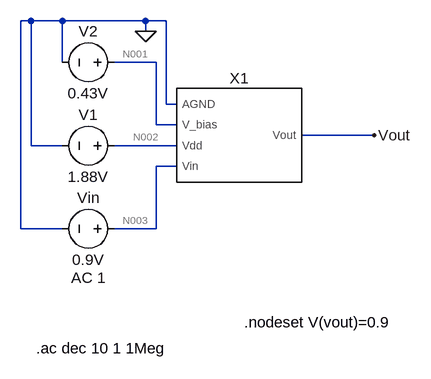
[diagram p0: schematic ota_c_lowpass_Slow.asc]
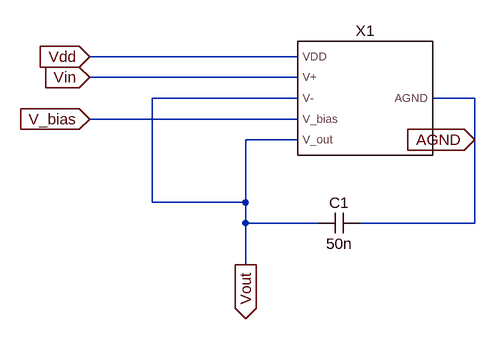
[diagram p1: sub-circuit ota_c_lowpass.asc]
ota_c_lowpass_Slow.asc, the LTspice schematic file:
Version 4.1
SHEET 1 880 680
WIRE -112 -16 -128 -16
WIRE -64 -16 -112 -16
WIRE 64 -16 -64 -16
WIRE 96 -16 64 -16
WIRE 64 0 64 -16
WIRE -64 48 -64 -16
WIRE 80 48 16 48
WIRE 96 112 96 -16
WIRE 112 112 96 112
WIRE 80 144 80 48
WIRE 112 144 80 144
WIRE 416 160 304 160
WIRE -112 176 -112 -16
WIRE -64 176 -112 176
WIRE 112 176 16 176
WIRE 112 208 80 208
WIRE -128 304 -128 -16
WIRE -64 304 -128 304
WIRE 80 304 80 208
WIRE 80 304 16 304
FLAG 64 0 0
FLAG 416 160 Vout
SYMBOL voltage 32 176 R90
WINDOW 0 -32 56 VBottom 2
WINDOW 3 32 56 VTop 2
SYMATTR InstName V1
SYMATTR Value 1.88V
SYMBOL voltage 32 304 R90
WINDOW 0 -32 56 VBottom 2
WINDOW 3 32 56 VTop 2
WINDOW 123 60 56 VTop 2
WINDOW 39 0 0 Left 0
SYMATTR InstName Vin
SYMATTR Value 0.9V
SYMATTR Value2 AC 1
SYMBOL voltage 32 48 R90
WINDOW 0 -32 56 VBottom 2
WINDOW 3 32 56 VTop 2
WINDOW 123 0 0 Left 0
WINDOW 39 0 0 Left 0
SYMATTR InstName V2
SYMATTR Value 0.43V
SYMBOL ota_c_lowpass 208 160 R0
SYMATTR InstName X1
TEXT -104 488 Left 2 !.ac dec 10 1 1Meg
TEXT 216 448 Left 2 !.nodeset V(vout)=0.9

ota_c_lowpass.asc, the sub-circuit schematic file:
Version 4.1
SHEET 1 880 680
WIRE 112 112 -208 112
WIRE 112 144 -208 144
WIRE 112 176 -112 176
WIRE 384 176 320 176
WIRE 112 208 -208 208
WIRE 112 240 32 240
WIRE 384 240 384 176
WIRE -112 336 -112 176
WIRE 32 336 32 240
WIRE 32 336 -112 336
WIRE 32 368 32 336
WIRE 144 368 32 368
WIRE 384 368 384 240
WIRE 384 368 208 368
WIRE 32 432 32 368
FLAG -208 144 Vin
IOPIN -208 144 In
FLAG 32 432 Vout
IOPIN 32 432 Out
FLAG -208 112 Vdd
IOPIN -208 112 In
FLAG -208 208 V_bias
IOPIN -208 208 In
FLAG 384 240 AGND
IOPIN 384 240 In
SYMBOL cap 208 352 R90
WINDOW 0 0 32 VBottom 2
WINDOW 3 32 32 VTop 2
SYMATTR InstName C1
SYMATTR Value 50n
SYMBOL ota_core 208 176 R0
SYMATTR InstName X1

The netlist it stands for:
* ota_c_lowpass_Slow.asc
V1 N002 0 1.88V
Vin N003 0 0.9V AC 1
V2 N001 0 0.43V
X§X1 0 N001 N002 N003 Vout ota_c_lowpass

* block symbol definitions
.subckt ota_c_lowpass AGND V_bias Vdd Vin Vout
C1 AGND Vout 50n
X§X1 Vdd Vin Vout V_bias Vout AGND ota_core  ; pins VDD V+ V- V_bias V_out AGND
.ends ota_c_lowpass

.ac dec 10 1 1Meg
.nodeset V(vout)=0.9
.backanno
.end

* Results of the author's LTspice run, read from the files saved beside the schematic
* Operating Point, zero values left out:
*   V(n001) = 430 mV
*   V(n002) = 1.88 V
*   V(n003) = 900 mV
*   V(vout) = 900.1 mV
*   I(V1) = -4.613 nA
*   Ix(x1:agnd) = -4.613 nA
*   Ix(x1:vdd) = 4.613 nA
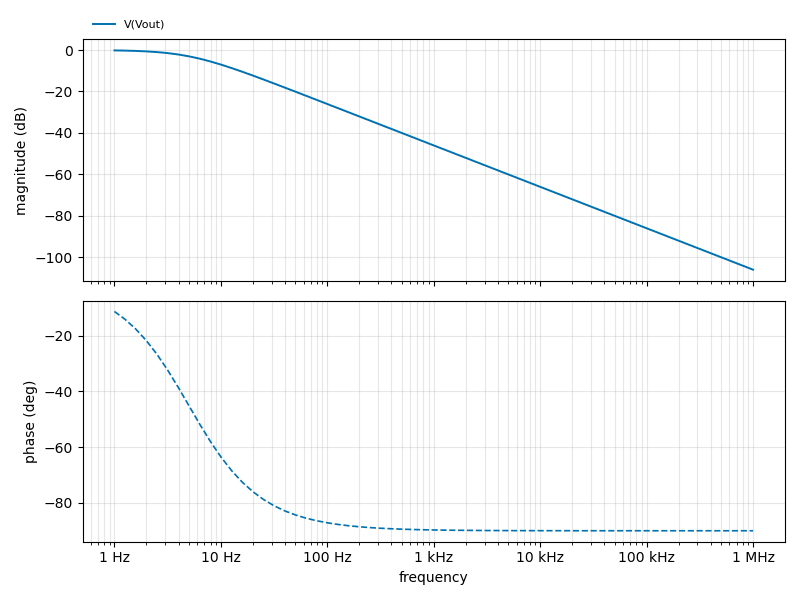
[diagram p2: AC Analysis of ota_c_lowpass_Slow.asc, plotted from the saved traces]
* AC Analysis, 1 run:
*   V(Vout): -0.17 dB at 1 Hz, -106.05 dB at 1 MHz, peak -0.17 dB at 1 Hz, 3 dB below the peak at 5.167 Hz